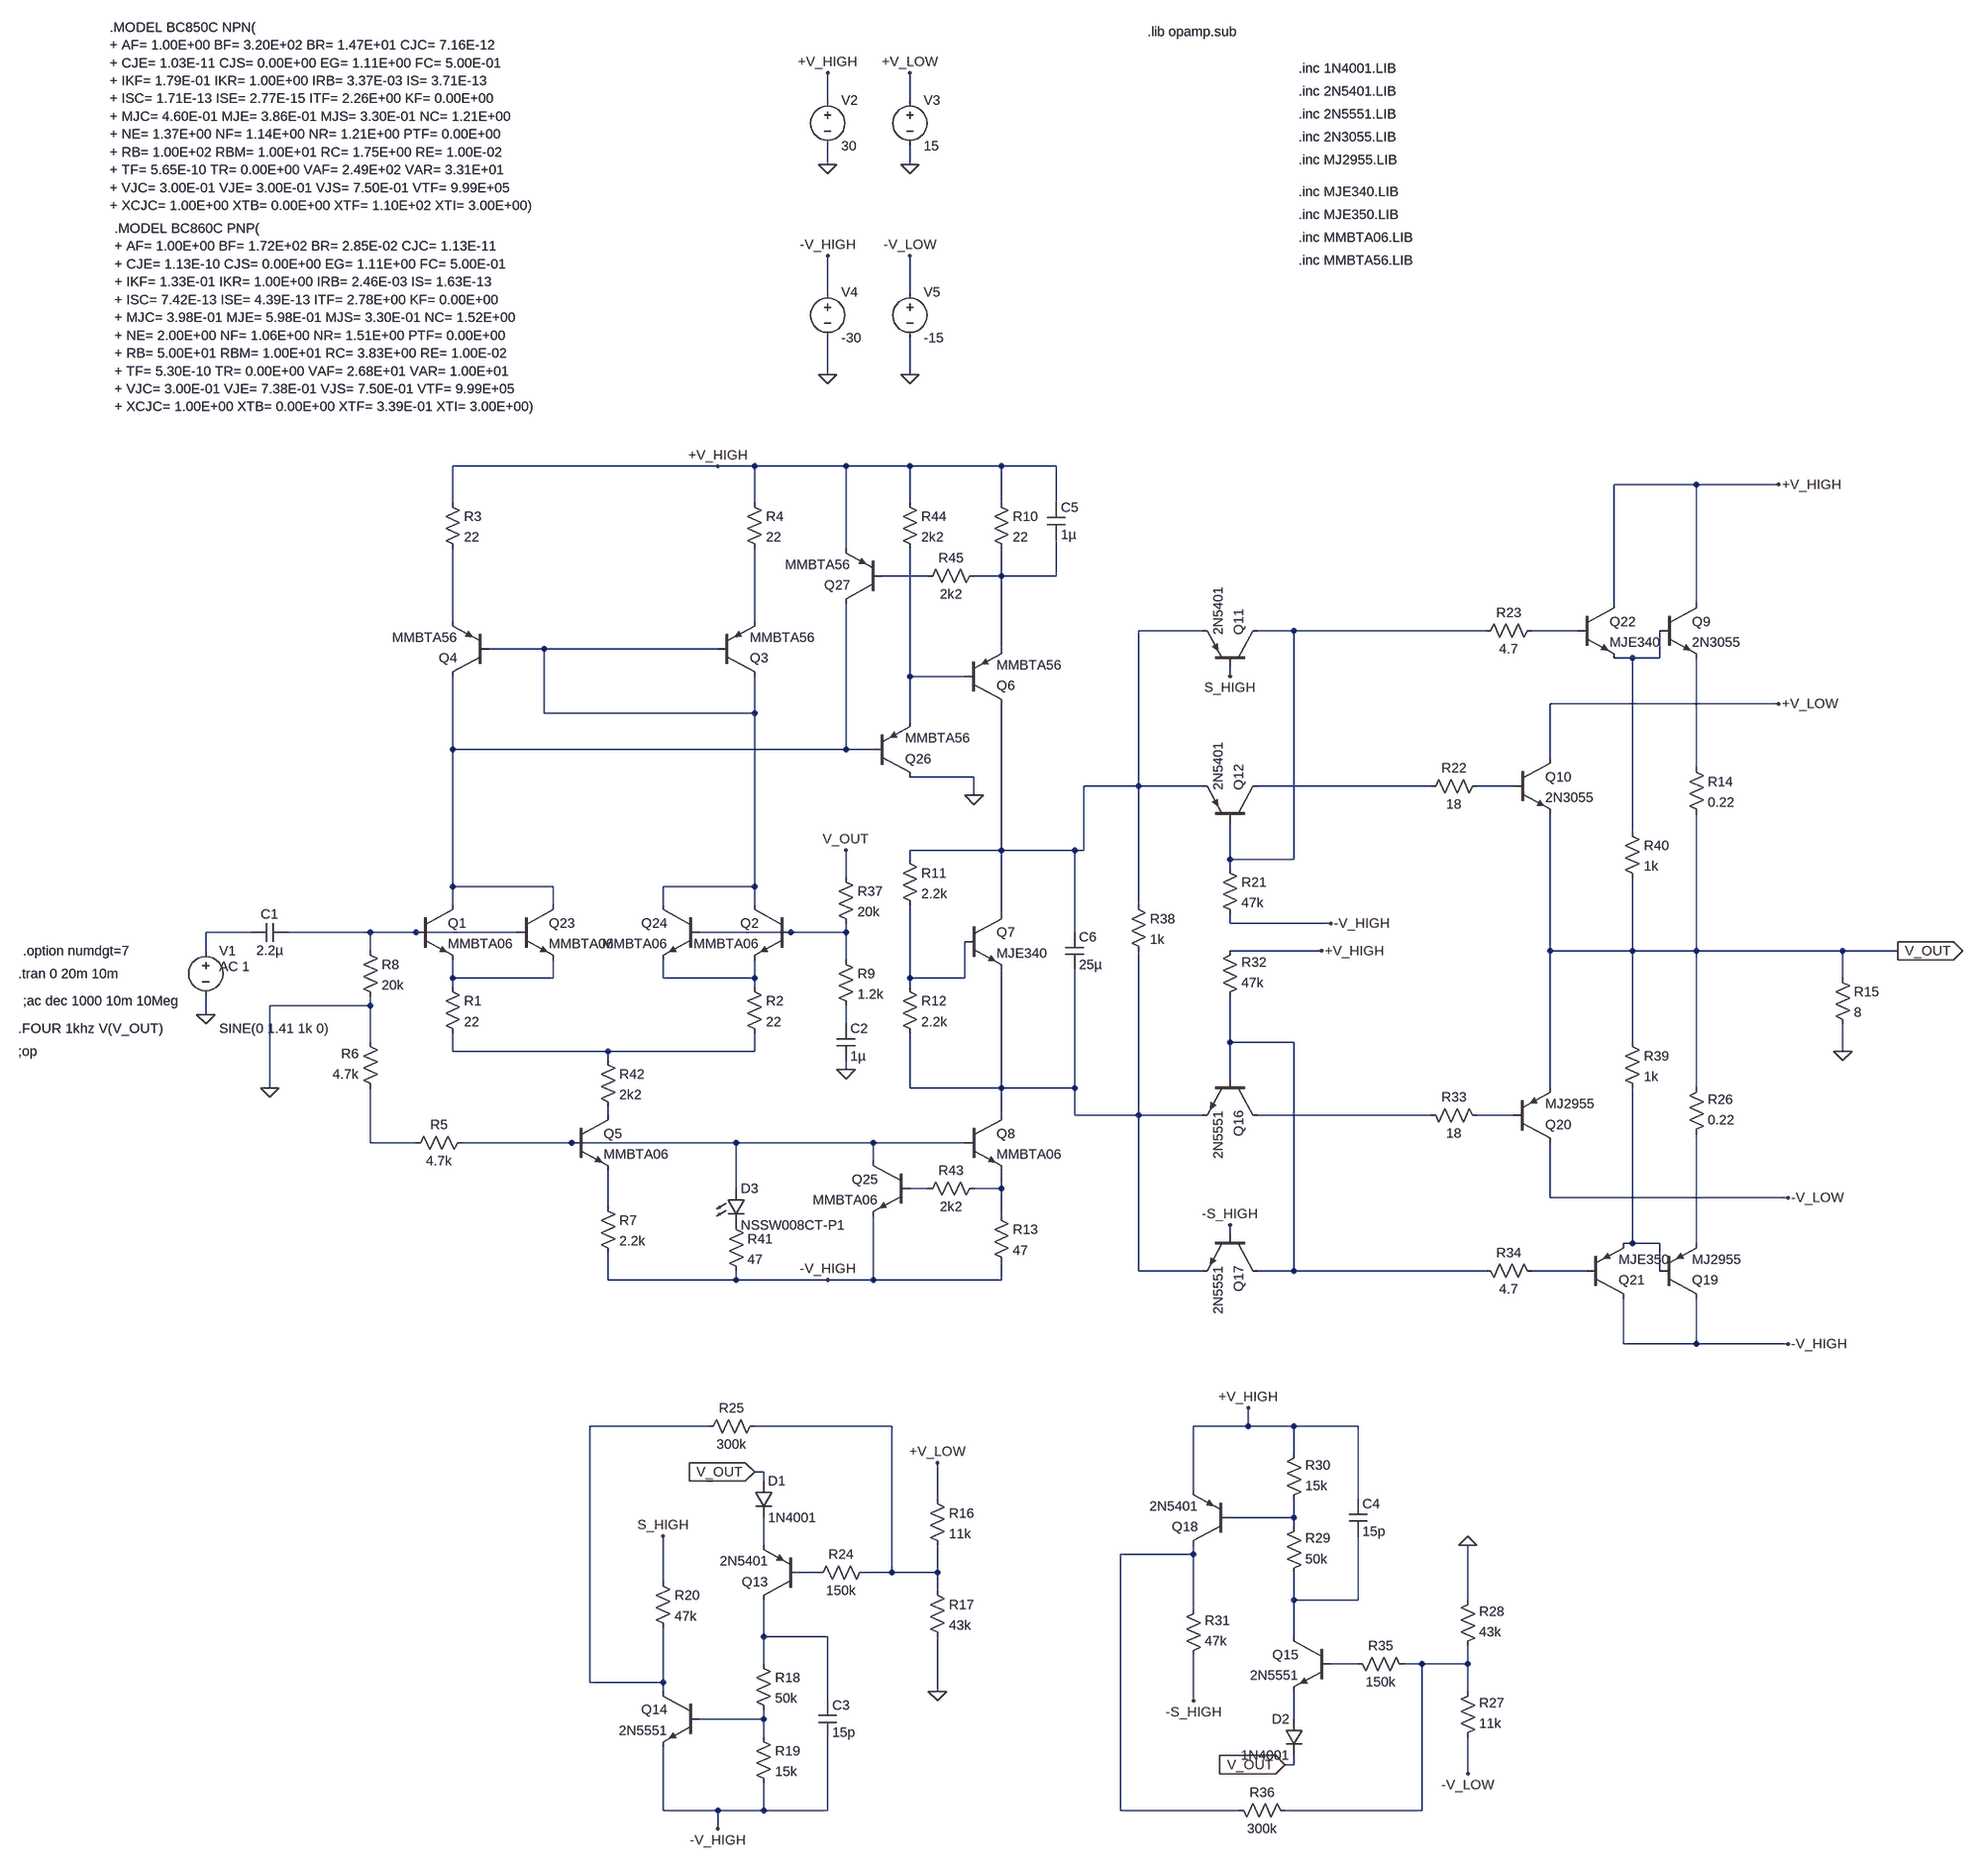
[diagram p0: schematic Draft3.asc]
Draft3.asc, the LTspice schematic file:
Version 4
SHEET 1 1564 1764
WIRE -448 -1408 -448 -1456
WIRE -304 -1408 -304 -1456
WIRE -448 -1296 -448 -1328
WIRE -304 -1296 -304 -1328
WIRE -448 -1072 -448 -1136
WIRE -304 -1072 -304 -1136
WIRE -448 -928 -448 -992
WIRE -304 -928 -304 -992
WIRE -640 -768 -1104 -768
WIRE -576 -768 -640 -768
WIRE -416 -768 -576 -768
WIRE -304 -768 -416 -768
WIRE -144 -768 -304 -768
WIRE -48 -768 -144 -768
WIRE 1072 -736 928 -736
WIRE 1216 -736 1072 -736
WIRE -1104 -704 -1104 -768
WIRE -576 -704 -576 -768
WIRE -304 -704 -304 -768
WIRE -144 -704 -144 -768
WIRE -48 -704 -48 -768
WIRE -416 -624 -416 -768
WIRE -272 -576 -352 -576
WIRE -144 -576 -144 -624
WIRE -144 -576 -192 -576
WIRE -48 -576 -48 -640
WIRE -48 -576 -144 -576
WIRE 928 -528 928 -736
WIRE 1072 -528 1072 -736
WIRE -1104 -496 -1104 -624
WIRE -576 -496 -576 -624
WIRE 208 -480 96 -480
WIRE 368 -480 304 -480
WIRE 704 -480 368 -480
WIRE 864 -480 784 -480
WIRE -944 -448 -1040 -448
WIRE -640 -448 -944 -448
WIRE -144 -448 -144 -576
WIRE 960 -432 928 -432
WIRE 1008 -432 1008 -480
WIRE 1008 -432 960 -432
WIRE -304 -400 -304 -624
WIRE -208 -400 -304 -400
WIRE 256 -400 256 -416
WIRE 1216 -352 816 -352
WIRE -944 -336 -944 -448
WIRE -576 -336 -576 -400
WIRE -576 -336 -944 -336
WIRE -304 -320 -304 -400
WIRE -1104 -272 -1104 -400
WIRE -416 -272 -416 -528
WIRE -416 -272 -1104 -272
WIRE -368 -272 -416 -272
WIRE 816 -256 816 -352
WIRE 1072 -240 1072 -432
WIRE -192 -224 -304 -224
WIRE 96 -208 96 -480
WIRE 96 -208 0 -208
WIRE 208 -208 96 -208
WIRE 608 -208 304 -208
WIRE 752 -208 688 -208
WIRE -192 -192 -192 -224
WIRE 960 -128 960 -432
WIRE -144 -96 -144 -352
WIRE -144 -96 -304 -96
WIRE -16 -96 -144 -96
WIRE 0 -96 0 -208
WIRE 0 -96 -16 -96
WIRE -304 -80 -304 -96
WIRE 256 -80 256 -144
WIRE 368 -80 368 -480
WIRE 368 -80 256 -80
WIRE 256 -64 256 -80
WIRE -416 -48 -416 -96
WIRE -1104 -32 -1104 -272
WIRE -928 -32 -1104 -32
WIRE -576 -32 -576 -336
WIRE -576 -32 -736 -32
WIRE -1104 0 -1104 -32
WIRE -928 0 -928 -32
WIRE -736 0 -736 -32
WIRE -576 0 -576 -32
WIRE 96 0 96 -208
WIRE -144 16 -144 -96
WIRE 256 32 256 16
WIRE 432 32 256 32
WIRE -1456 48 -1536 48
WIRE -1248 48 -1392 48
WIRE -1168 48 -1248 48
WIRE -992 48 -1168 48
WIRE -512 48 -672 48
WIRE -416 48 -416 32
WIRE -416 48 -512 48
WIRE -16 48 -16 -96
WIRE -1536 80 -1536 48
WIRE -1248 80 -1248 48
WIRE 416 80 256 80
WIRE 816 80 816 -160
WIRE 960 80 960 -48
WIRE 960 80 816 80
WIRE 1072 80 1072 -160
WIRE 1072 80 960 80
WIRE 1328 80 1072 80
WIRE 1424 80 1328 80
WIRE -416 96 -416 48
WIRE -1104 128 -1104 96
WIRE -928 128 -928 96
WIRE -928 128 -1104 128
WIRE -736 128 -736 96
WIRE -576 128 -576 96
WIRE -576 128 -736 128
WIRE -304 128 -304 0
WIRE -208 128 -208 64
WIRE -208 128 -304 128
WIRE 1328 128 1328 80
WIRE -1104 144 -1104 128
WIRE -576 144 -576 128
WIRE -304 144 -304 128
WIRE -1248 176 -1248 160
WIRE -1248 176 -1424 176
WIRE -1536 192 -1536 160
WIRE -416 208 -416 176
WIRE -1248 240 -1248 176
WIRE 256 240 256 160
WIRE 368 240 256 240
WIRE 960 240 960 80
WIRE -1104 256 -1104 224
WIRE -832 256 -1104 256
WIRE -576 256 -576 224
WIRE -576 256 -832 256
WIRE 1328 256 1328 208
WIRE -832 272 -832 256
WIRE -416 288 -416 272
WIRE 256 304 256 240
WIRE -1424 320 -1424 176
WIRE -304 320 -304 224
WIRE -144 320 -144 112
WIRE -144 320 -304 320
WIRE -16 320 -16 112
WIRE -16 320 -144 320
WIRE 816 320 816 80
WIRE 1072 320 1072 80
WIRE -832 368 -832 352
WIRE -144 368 -144 320
WIRE -16 368 -16 320
WIRE 96 368 96 80
WIRE 96 368 -16 368
WIRE 208 368 96 368
WIRE 608 368 304 368
WIRE 752 368 688 368
WIRE -1248 416 -1248 320
WIRE -1168 416 -1248 416
WIRE -896 416 -1088 416
WIRE -608 416 -896 416
WIRE -368 416 -608 416
WIRE -208 416 -368 416
WIRE -368 448 -368 416
WIRE -608 496 -608 416
WIRE -272 496 -304 496
WIRE -144 496 -144 464
WIRE -144 496 -192 496
WIRE 816 512 816 416
WIRE 1232 512 816 512
WIRE -832 528 -832 464
WIRE -144 544 -144 496
WIRE 256 576 256 560
WIRE 960 592 960 320
WIRE 960 592 944 592
WIRE 1008 592 960 592
WIRE 1072 592 1072 400
WIRE 96 640 96 368
WIRE 208 640 96 640
WIRE 368 640 368 240
WIRE 368 640 304 640
WIRE 704 640 368 640
WIRE 880 640 784 640
WIRE 1008 640 1008 592
WIRE -832 656 -832 608
WIRE -608 656 -608 640
WIRE -608 656 -832 656
WIRE -448 656 -608 656
WIRE -368 656 -368 544
WIRE -368 656 -448 656
WIRE -144 656 -144 624
WIRE -144 656 -368 656
WIRE 944 768 944 688
WIRE 1072 768 1072 688
WIRE 1072 768 944 768
WIRE 1232 768 1072 768
WIRE -656 912 -864 912
WIRE -336 912 -576 912
WIRE 288 912 288 880
WIRE 288 912 192 912
WIRE 368 912 288 912
WIRE 480 912 368 912
WIRE 368 960 368 912
WIRE -560 992 -576 992
WIRE -560 1008 -560 992
WIRE 192 1024 192 912
WIRE -256 1040 -256 976
WIRE 480 1040 480 912
WIRE 368 1072 368 1040
WIRE 368 1072 256 1072
WIRE 368 1088 368 1072
WIRE -560 1120 -560 1072
WIRE 192 1136 192 1120
WIRE 192 1136 64 1136
WIRE -464 1168 -496 1168
WIRE -336 1168 -336 912
WIRE -336 1168 -384 1168
WIRE -256 1168 -256 1120
WIRE -256 1168 -336 1168
WIRE -736 1184 -736 1104
WIRE -256 1200 -256 1168
WIRE 368 1216 368 1168
WIRE 480 1216 480 1104
WIRE 480 1216 368 1216
WIRE 672 1216 672 1120
WIRE 192 1232 192 1136
WIRE -560 1280 -560 1216
WIRE -448 1280 -560 1280
WIRE 368 1280 368 1216
WIRE -560 1328 -560 1280
WIRE 480 1328 432 1328
WIRE 592 1328 560 1328
WIRE 672 1328 672 1296
WIRE 672 1328 592 1328
WIRE -864 1360 -864 912
WIRE -736 1360 -736 1264
WIRE -736 1360 -864 1360
WIRE -736 1376 -736 1360
WIRE -256 1376 -256 1280
WIRE 672 1376 672 1328
WIRE -448 1392 -448 1280
WIRE 192 1392 192 1312
WIRE -560 1424 -560 1408
WIRE -560 1424 -672 1424
WIRE 368 1424 368 1376
WIRE -560 1456 -560 1424
WIRE 368 1504 368 1488
WIRE 368 1504 352 1504
WIRE 672 1520 672 1456
WIRE -736 1584 -736 1472
WIRE -640 1584 -736 1584
WIRE -560 1584 -560 1536
WIRE -560 1584 -640 1584
WIRE -448 1584 -448 1456
WIRE -448 1584 -560 1584
WIRE 64 1584 64 1136
WIRE 272 1584 64 1584
WIRE 592 1584 592 1328
WIRE 592 1584 352 1584
WIRE -640 1616 -640 1584
FLAG -1424 320 0
FLAG -416 288 0
FLAG -1536 192 0
FLAG 1216 -736 +V_HIGH
FLAG 1216 -352 +V_LOW
FLAG 1328 256 0
FLAG -256 1376 0
FLAG -256 976 +V_LOW
FLAG 1424 80 V_OUT
IOPIN 1424 80 Out
FLAG -576 992 V_OUT
IOPIN -576 992 In
FLAG -640 1616 -V_HIGH
FLAG 256 -400 S_HIGH
FLAG -736 1104 S_HIGH
FLAG 432 32 -V_HIGH
FLAG 1232 768 -V_HIGH
FLAG 1232 512 -V_LOW
FLAG 672 1120 0
FLAG 672 1520 -V_LOW
FLAG 352 1504 V_OUT
IOPIN 352 1504 In
FLAG 288 880 +V_HIGH
FLAG 256 560 -S_HIGH
FLAG 192 1392 -S_HIGH
FLAG 416 80 +V_HIGH
FLAG -448 -1296 0
FLAG -304 -1296 0
FLAG -448 -1456 +V_HIGH
FLAG -304 -1456 +V_LOW
FLAG -448 -928 0
FLAG -304 -928 0
FLAG -448 -1136 -V_HIGH
FLAG -304 -1136 -V_LOW
FLAG -640 -768 +V_HIGH
FLAG -448 656 -V_HIGH
FLAG -416 -96 V_OUT
FLAG -192 -192 0
SYMBOL npn -1168 0 R0
SYMATTR InstName Q1
SYMATTR Value MMBTA06
SYMBOL npn -512 0 M0
SYMATTR InstName Q2
SYMATTR Value MMBTA06
SYMBOL pnp -640 -400 M180
SYMATTR InstName Q3
SYMATTR Value MMBTA56
SYMBOL pnp -1040 -400 R180
SYMATTR InstName Q4
SYMATTR Value MMBTA56
SYMBOL res -1120 128 R0
SYMATTR InstName R1
SYMATTR Value 22
SYMBOL res -592 128 R0
SYMATTR InstName R2
SYMATTR Value 22
SYMBOL res -1120 -720 R0
SYMATTR InstName R3
SYMATTR Value 22
SYMBOL res -592 -720 R0
SYMATTR InstName R4
SYMATTR Value 22
SYMBOL npn -896 368 R0
SYMATTR InstName Q5
SYMATTR Value MMBTA06
SYMBOL res -1072 400 R90
WINDOW 0 0 56 VBottom 2
WINDOW 3 32 56 VTop 2
SYMATTR InstName R5
SYMATTR Value 4.7k
SYMBOL res -1232 336 R180
WINDOW 0 36 76 Left 2
WINDOW 3 36 40 Left 2
SYMATTR InstName R6
SYMATTR Value 4.7k
SYMBOL res -848 512 R0
SYMATTR InstName R7
SYMATTR Value 2.2k
SYMBOL res -1264 64 R0
SYMATTR InstName R8
SYMATTR Value 20k
SYMBOL res -432 80 R0
SYMATTR InstName R9
SYMATTR Value 1.2k
SYMBOL cap -1392 32 R90
WINDOW 0 0 32 VBottom 2
WINDOW 3 32 32 VTop 2
SYMATTR InstName C1
SYMATTR Value 2.2µ
SYMBOL voltage -1536 64 R0
WINDOW 3 24 152 Left 2
WINDOW 123 24 44 Left 2
WINDOW 39 0 0 Left 0
SYMATTR Value SINE(0 1.41 1k 0)
SYMATTR Value2 AC 1
SYMATTR InstName V1
SYMBOL pnp -208 -352 M180
SYMATTR InstName Q6
SYMATTR Value MMBTA56
SYMBOL res -160 -720 R0
SYMATTR InstName R10
SYMATTR Value 22
SYMBOL npn -208 16 R0
SYMATTR InstName Q7
SYMATTR Value MJE340
SYMBOL res -320 -96 R0
SYMATTR InstName R11
SYMATTR Value 2.2k
SYMBOL res -320 128 R0
SYMATTR InstName R12
SYMATTR Value 2.2k
SYMBOL npn -208 368 R0
SYMATTR InstName Q8
SYMATTR Value MMBTA06
SYMBOL res -160 528 R0
SYMATTR InstName R13
SYMATTR Value 47
SYMBOL cap -432 208 R0
SYMATTR InstName C2
SYMATTR Value 1µ
SYMBOL npn 1008 -528 R0
SYMATTR InstName Q9
SYMATTR Value 2N3055
SYMBOL npn 752 -256 R0
SYMATTR InstName Q10
SYMATTR Value 2N3055
SYMBOL res 1056 -256 R0
SYMATTR InstName R14
SYMATTR Value 0.22
SYMBOL pnp 304 -416 M270
SYMATTR InstName Q11
SYMATTR Value 2N5401
SYMBOL pnp 304 -144 M270
SYMATTR InstName Q12
SYMATTR Value 2N5401
SYMBOL res 1312 112 R0
SYMATTR InstName R15
SYMATTR Value 8
SYMBOL res -272 1024 R0
SYMATTR InstName R16
SYMATTR Value 11k
SYMBOL res -272 1184 R0
SYMATTR InstName R17
SYMATTR Value 43k
SYMBOL pnp -496 1216 R180
SYMATTR InstName Q13
SYMATTR Value 2N5401
SYMBOL res -576 1312 R0
SYMATTR InstName R18
SYMATTR Value 50k
SYMBOL res -576 1440 R0
SYMATTR InstName R19
SYMATTR Value 15k
SYMBOL npn -672 1376 M0
SYMATTR InstName Q14
SYMATTR Value 2N5551
SYMBOL res -752 1168 R0
SYMATTR InstName R20
SYMATTR Value 47k
SYMBOL res 240 -80 R0
SYMATTR InstName R21
SYMATTR Value 47k
SYMBOL cap -464 1392 R0
SYMATTR InstName C3
SYMATTR Value 15p
SYMBOL diode -576 1008 R0
SYMATTR InstName D1
SYMATTR Value 1N4001
SYMBOL res 704 -224 R90
WINDOW 0 0 56 VBottom 2
WINDOW 3 32 56 VTop 2
SYMATTR InstName R22
SYMATTR Value 18
SYMBOL res 800 -496 R90
WINDOW 0 0 56 VBottom 2
WINDOW 3 32 56 VTop 2
SYMATTR InstName R23
SYMATTR Value 4.7
SYMBOL res -368 1152 R90
WINDOW 0 0 56 VBottom 2
WINDOW 3 32 56 VTop 2
SYMATTR InstName R24
SYMATTR Value 150k
SYMBOL res -560 896 R90
WINDOW 0 0 56 VBottom 2
WINDOW 3 32 56 VTop 2
SYMATTR InstName R25
SYMATTR Value 300k
SYMBOL res 1056 416 M180
WINDOW 0 36 76 Left 2
WINDOW 3 36 40 Left 2
SYMATTR InstName R26
SYMATTR Value 0.22
SYMBOL res 656 1472 M180
WINDOW 0 36 76 Left 2
WINDOW 3 36 40 Left 2
SYMATTR InstName R27
SYMATTR Value 11k
SYMBOL res 656 1312 M180
WINDOW 0 36 76 Left 2
WINDOW 3 36 40 Left 2
SYMATTR InstName R28
SYMATTR Value 43k
SYMBOL res 352 1184 M180
WINDOW 0 36 76 Left 2
WINDOW 3 36 40 Left 2
SYMATTR InstName R29
SYMATTR Value 50k
SYMBOL res 352 1056 M180
WINDOW 0 36 76 Left 2
WINDOW 3 36 40 Left 2
SYMATTR InstName R30
SYMATTR Value 15k
SYMBOL res 176 1328 M180
WINDOW 0 36 76 Left 2
WINDOW 3 36 40 Left 2
SYMATTR InstName R31
SYMATTR Value 47k
SYMBOL res 240 176 M180
WINDOW 0 36 76 Left 2
WINDOW 3 36 40 Left 2
SYMATTR InstName R32
SYMATTR Value 47k
SYMBOL cap 464 1104 M180
WINDOW 0 24 56 Left 2
WINDOW 3 24 8 Left 2
SYMATTR InstName C4
SYMATTR Value 15p
SYMBOL diode 384 1424 M0
SYMATTR InstName D2
SYMATTR Value 1N4001
SYMBOL res 704 384 M270
WINDOW 0 32 56 VTop 2
WINDOW 3 0 56 VBottom 2
SYMATTR InstName R33
SYMATTR Value 18
SYMBOL res 800 656 M270
WINDOW 0 32 56 VTop 2
WINDOW 3 0 56 VBottom 2
SYMATTR InstName R34
SYMATTR Value 4.7
SYMBOL res 576 1344 M270
WINDOW 0 32 56 VTop 2
WINDOW 3 0 56 VBottom 2
SYMATTR InstName R35
SYMATTR Value 150k
SYMBOL res 368 1600 M270
WINDOW 0 32 56 VTop 2
WINDOW 3 0 56 VBottom 2
SYMATTR InstName R36
SYMATTR Value 300k
SYMBOL npn 432 1280 M0
SYMATTR InstName Q15
SYMATTR Value 2N5551
SYMBOL npn 304 304 R90
SYMATTR InstName Q16
SYMATTR Value 2N5551
SYMBOL npn 304 576 R90
SYMATTR InstName Q17
SYMATTR Value 2N5551
SYMBOL pnp 256 1120 R180
SYMATTR InstName Q18
SYMATTR Value 2N5401
SYMBOL pnp 1008 688 M180
SYMATTR InstName Q19
SYMATTR Value MJ2955
SYMBOL pnp 752 416 M180
SYMATTR InstName Q20
SYMATTR Value MJ2955
SYMBOL voltage -448 -1424 R0
WINDOW 123 0 0 Left 0
WINDOW 39 0 0 Left 0
SYMATTR InstName V2
SYMATTR Value 30
SYMBOL voltage -304 -1424 R0
WINDOW 123 0 0 Left 0
WINDOW 39 0 0 Left 0
SYMATTR InstName V3
SYMATTR Value 15
SYMBOL voltage -448 -1088 R0
WINDOW 123 0 0 Left 0
WINDOW 39 0 0 Left 0
SYMATTR InstName V4
SYMATTR Value -30
SYMBOL voltage -304 -1088 R0
WINDOW 123 0 0 Left 0
WINDOW 39 0 0 Left 0
SYMATTR InstName V5
SYMATTR Value -15
SYMBOL res -432 -64 R0
SYMATTR InstName R37
SYMATTR Value 20k
SYMBOL res 80 -16 R0
SYMATTR InstName R38
SYMATTR Value 1k
SYMBOL LED -624 496 R0
SYMATTR InstName D3
SYMATTR Value NSSW008CT-P1
SYMBOL cap -64 -704 R0
SYMATTR InstName C5
SYMATTR Value 1µ
SYMBOL pnp 880 688 M180
SYMATTR InstName Q21
SYMATTR Value MJE350
SYMBOL res 944 224 R0
SYMATTR InstName R39
SYMATTR Value 1k
SYMBOL npn 864 -528 R0
SYMATTR InstName Q22
SYMATTR Value MJE340
SYMBOL res 944 -144 R0
SYMATTR InstName R40
SYMATTR Value 1k
SYMBOL res -624 544 R0
SYMATTR InstName R41
SYMATTR Value 47
SYMBOL npn -992 0 R0
SYMATTR InstName Q23
SYMATTR Value MMBTA06
SYMBOL npn -672 0 M0
SYMATTR InstName Q24
SYMATTR Value MMBTA06
SYMBOL res -848 256 R0
SYMATTR InstName R42
SYMATTR Value 2k2
SYMBOL npn -304 448 M0
SYMATTR InstName Q25
SYMATTR Value MMBTA06
SYMBOL res -176 480 R90
WINDOW 0 0 56 VBottom 2
WINDOW 3 32 56 VTop 2
SYMATTR InstName R43
SYMATTR Value 2k2
SYMBOL pnp -368 -224 M180
SYMATTR InstName Q26
SYMATTR Value MMBTA56
SYMBOL pnp -352 -528 R180
SYMATTR InstName Q27
SYMATTR Value MMBTA56
SYMBOL res -320 -720 R0
SYMATTR InstName R44
SYMATTR Value 2k2
SYMBOL res -176 -592 R90
WINDOW 0 0 56 VBottom 2
WINDOW 3 32 56 VTop 2
SYMATTR InstName R45
SYMATTR Value 2k2
SYMBOL cap -32 48 R0
SYMATTR InstName C6
SYMATTR Value 25µ
TEXT -1864 120 Left 2 !.tran 0 20m 10m
TEXT -1864 216 Left 2 !.FOUR 1khz V(V_OUT)
TEXT 376 -1304 Left 2 !.inc MJ2955.LIB
TEXT 376 -1344 Left 2 !.inc 2N3055.LIB
TEXT 376 -1384 Left 2 !.inc 2N5551.LIB
TEXT 376 -1424 Left 2 !.inc 2N5401.LIB
TEXT 376 -1464 Left 2 !.inc 1N4001.LIB
TEXT -1704 -1536 Left 2 !.MODEL BC850C NPN(\n+ AF= 1.00E+00 BF= 3.20E+02 BR= 1.47E+01 CJC= 7.16E-12\n+ CJE= 1.03E-11 CJS= 0.00E+00 EG= 1.11E+00 FC= 5.00E-01\n+ IKF= 1.79E-01 IKR= 1.00E+00 IRB= 3.37E-03 IS= 3.71E-13\n+ ISC= 1.71E-13 ISE= 2.77E-15 ITF= 2.26E+00 KF= 0.00E+00\n+ MJC= 4.60E-01 MJE= 3.86E-01 MJS= 3.30E-01 NC= 1.21E+00\n+ NE= 1.37E+00 NF= 1.14E+00 NR= 1.21E+00 PTF= 0.00E+00\n+ RB= 1.00E+02 RBM= 1.00E+01 RC= 1.75E+00 RE= 1.00E-02\n+ TF= 5.65E-10 TR= 0.00E+00 VAF= 2.49E+02 VAR= 3.31E+01\n+ VJC= 3.00E-01 VJE= 3.00E-01 VJS= 7.50E-01 VTF= 9.99E+05\n+ XCJC= 1.00E+00 XTB= 0.00E+00 XTF= 1.10E+02 XTI= 3.00E+00)
TEXT -1696 -1184 Left 2 !.MODEL BC860C PNP(\n+ AF= 1.00E+00 BF= 1.72E+02 BR= 2.85E-02 CJC= 1.13E-11\n+ CJE= 1.13E-10 CJS= 0.00E+00 EG= 1.11E+00 FC= 5.00E-01\n+ IKF= 1.33E-01 IKR= 1.00E+00 IRB= 2.46E-03 IS= 1.63E-13\n+ ISC= 7.42E-13 ISE= 4.39E-13 ITF= 2.78E+00 KF= 0.00E+00\n+ MJC= 3.98E-01 MJE= 5.98E-01 MJS= 3.30E-01 NC= 1.52E+00\n+ NE= 2.00E+00 NF= 1.06E+00 NR= 1.51E+00 PTF= 0.00E+00\n+ RB= 5.00E+01 RBM= 1.00E+01 RC= 3.83E+00 RE= 1.00E-02\n+ TF= 5.30E-10 TR= 0.00E+00 VAF= 2.68E+01 VAR= 1.00E+01\n+ VJC= 3.00E-01 VJE= 7.38E-01 VJS= 7.50E-01 VTF= 9.99E+05\n+ XCJC= 1.00E+00 XTB= 0.00E+00 XTF= 3.39E-01 XTI= 3.00E+00)
TEXT 112 -1528 Left 2 !.lib opamp.sub
TEXT -1856 168 Left 2 !;ac dec 1000 10m 10Meg
TEXT -1864 256 Left 2 !;op
TEXT -1856 80 Left 2 !.option numdgt=7
TEXT 376 -1168 Left 2 !.inc MMBTA06.LIB
TEXT 376 -1128 Left 2 !.inc MMBTA56.LIB
TEXT 376 -1248 Left 2 !.inc MJE340.LIB
TEXT 376 -1208 Left 2 !.inc MJE350.LIB

The netlist it stands for:
* Draft3.asc
Q1 N011 N016 N018 0 MMBTA06
Q2 N008 N017 N019 0 MMBTA06
Q3 N008 N008 N004 0 MMBTA56
Q4 N011 N008 N003 0 MMBTA56
R1 N018 N023 22
R2 N019 N023 22
R3 +V_HIGH N003 22
R4 +V_HIGH N004 22
Q5 N025 N029 N032 0 MMBTA06
R5 N029 N028 4.7k
R6 N028 0 4.7k
R7 N032 -V_HIGH 2.2k
R8 N016 0 20k
R9 N017 N021 1.2k
C1 N016 N015 2.2µ
V1 N015 0 SINE(0 1.41 1k 0) AC 1
Q6 N005 N010 N002 0 MMBTA56
R10 +V_HIGH N002 22
Q7 N005 N020 N024 0 MJE340
R11 N005 N020 2.2k
R12 N020 N024 2.2k
Q8 N024 N029 N031 0 MMBTA06
R13 N031 -V_HIGH 47
C2 N021 0 1µ
Q9 +V_HIGH N009 N012 0 2N3055
Q10 +V_LOW N014 V_OUT 0 2N3055
R14 N012 V_OUT 0.22
Q11 N006 S_HIGH N005 0 2N5401
Q12 N013 N006 N005 0 2N5401
R15 V_OUT 0 8
R16 +V_LOW N037 11k
R17 N037 0 43k
Q13 N043 N041 N039 0 2N5401
R18 N043 N046 50k
R19 N046 -V_HIGH 15k
Q14 N036 N046 -V_HIGH 0 2N5551
R20 S_HIGH N036 47k
R21 N006 -V_HIGH 47k
C3 N043 -V_HIGH 15p
D1 V_OUT N039 1N4001
R22 N014 N013 18
R23 N007 N006 4.7
R24 N037 N041 150k
R25 N037 N036 300k
R26 N034 V_OUT 0.22
R27 -V_LOW N045 11k
R28 N045 0 43k
R29 N042 N038 50k
R30 N038 +V_HIGH 15k
R31 -S_HIGH N040 47k
R32 N022 +V_HIGH 47k
C4 N042 +V_HIGH 15p
D2 N047 V_OUT 1N4001
R33 N027 N026 18
R34 N035 N022 4.7
R35 N045 N044 150k
R36 N045 N040 300k
Q15 N042 N044 N047 0 2N5551
Q16 N026 N022 N024 0 2N5551
Q17 N022 -S_HIGH N024 0 2N5551
Q18 N040 N038 +V_HIGH 0 2N5401
Q19 -V_HIGH N033 N034 0 MJ2955
Q20 -V_LOW N027 V_OUT 0 MJ2955
V2 +V_HIGH 0 30
V3 +V_LOW 0 15
V4 -V_HIGH 0 -30
V5 -V_LOW 0 -15
R37 V_OUT N017 20k
R38 N005 N024 1k
D3 N029 P001 NSSW008CT-P1
C5 +V_HIGH N002 1µ
Q21 -V_HIGH N035 N033 0 MJE350
R39 V_OUT N033 1k
Q22 +V_HIGH N007 N009 0 MJE340
R40 N009 V_OUT 1k
R41 P001 -V_HIGH 47
Q23 N011 N016 N018 0 MMBTA06
Q24 N008 N017 N019 0 MMBTA06
R42 N023 N025 2k2
Q25 N029 N030 -V_HIGH 0 MMBTA06
R43 N031 N030 2k2
Q26 0 N011 N010 0 MMBTA56
Q27 N011 N001 +V_HIGH 0 MMBTA56
R44 +V_HIGH N010 2k2
R45 N002 N001 2k2
C6 N005 N024 25µ
.model D D
.lib standard.dio
.model NPN NPN
.model PNP PNP
.lib standard.bjt
.tran 0 20m 10m
.FOUR 1khz V(V_OUT)
.inc MJ2955.LIB
.inc 2N3055.LIB
.inc 2N5551.LIB
.inc 2N5401.LIB
.inc 1N4001.LIB
.MODEL BC850C NPN(
+ AF= 1.00E+00 BF= 3.20E+02 BR= 1.47E+01 CJC= 7.16E-12
+ CJE= 1.03E-11 CJS= 0.00E+00 EG= 1.11E+00 FC= 5.00E-01
+ IKF= 1.79E-01 IKR= 1.00E+00 IRB= 3.37E-03 IS= 3.71E-13
+ ISC= 1.71E-13 ISE= 2.77E-15 ITF= 2.26E+00 KF= 0.00E+00
+ MJC= 4.60E-01 MJE= 3.86E-01 MJS= 3.30E-01 NC= 1.21E+00
+ NE= 1.37E+00 NF= 1.14E+00 NR= 1.21E+00 PTF= 0.00E+00
+ RB= 1.00E+02 RBM= 1.00E+01 RC= 1.75E+00 RE= 1.00E-02
+ TF= 5.65E-10 TR= 0.00E+00 VAF= 2.49E+02 VAR= 3.31E+01
+ VJC= 3.00E-01 VJE= 3.00E-01 VJS= 7.50E-01 VTF= 9.99E+05
+ XCJC= 1.00E+00 XTB= 0.00E+00 XTF= 1.10E+02 XTI= 3.00E+00)
.MODEL BC860C PNP(
+ AF= 1.00E+00 BF= 1.72E+02 BR= 2.85E-02 CJC= 1.13E-11
+ CJE= 1.13E-10 CJS= 0.00E+00 EG= 1.11E+00 FC= 5.00E-01
+ IKF= 1.33E-01 IKR= 1.00E+00 IRB= 2.46E-03 IS= 1.63E-13
+ ISC= 7.42E-13 ISE= 4.39E-13 ITF= 2.78E+00 KF= 0.00E+00
+ MJC= 3.98E-01 MJE= 5.98E-01 MJS= 3.30E-01 NC= 1.52E+00
+ NE= 2.00E+00 NF= 1.06E+00 NR= 1.51E+00 PTF= 0.00E+00
+ RB= 5.00E+01 RBM= 1.00E+01 RC= 3.83E+00 RE= 1.00E-02
+ TF= 5.30E-10 TR= 0.00E+00 VAF= 2.68E+01 VAR= 1.00E+01
+ VJC= 3.00E-01 VJE= 7.38E-01 VJS= 7.50E-01 VTF= 9.99E+05
+ XCJC= 1.00E+00 XTB= 0.00E+00 XTF= 3.39E-01 XTI= 3.00E+00)
.lib opamp.sub
;ac dec 1000 10m 10Meg
;op
.option numdgt=7
.inc MMBTA06.LIB
.inc MMBTA56.LIB
.inc MJE340.LIB
.inc MJE350.LIB
.backanno
.end